# EAGLE design STorM32 NT BGC v242 (EAGLE 7.5.0)
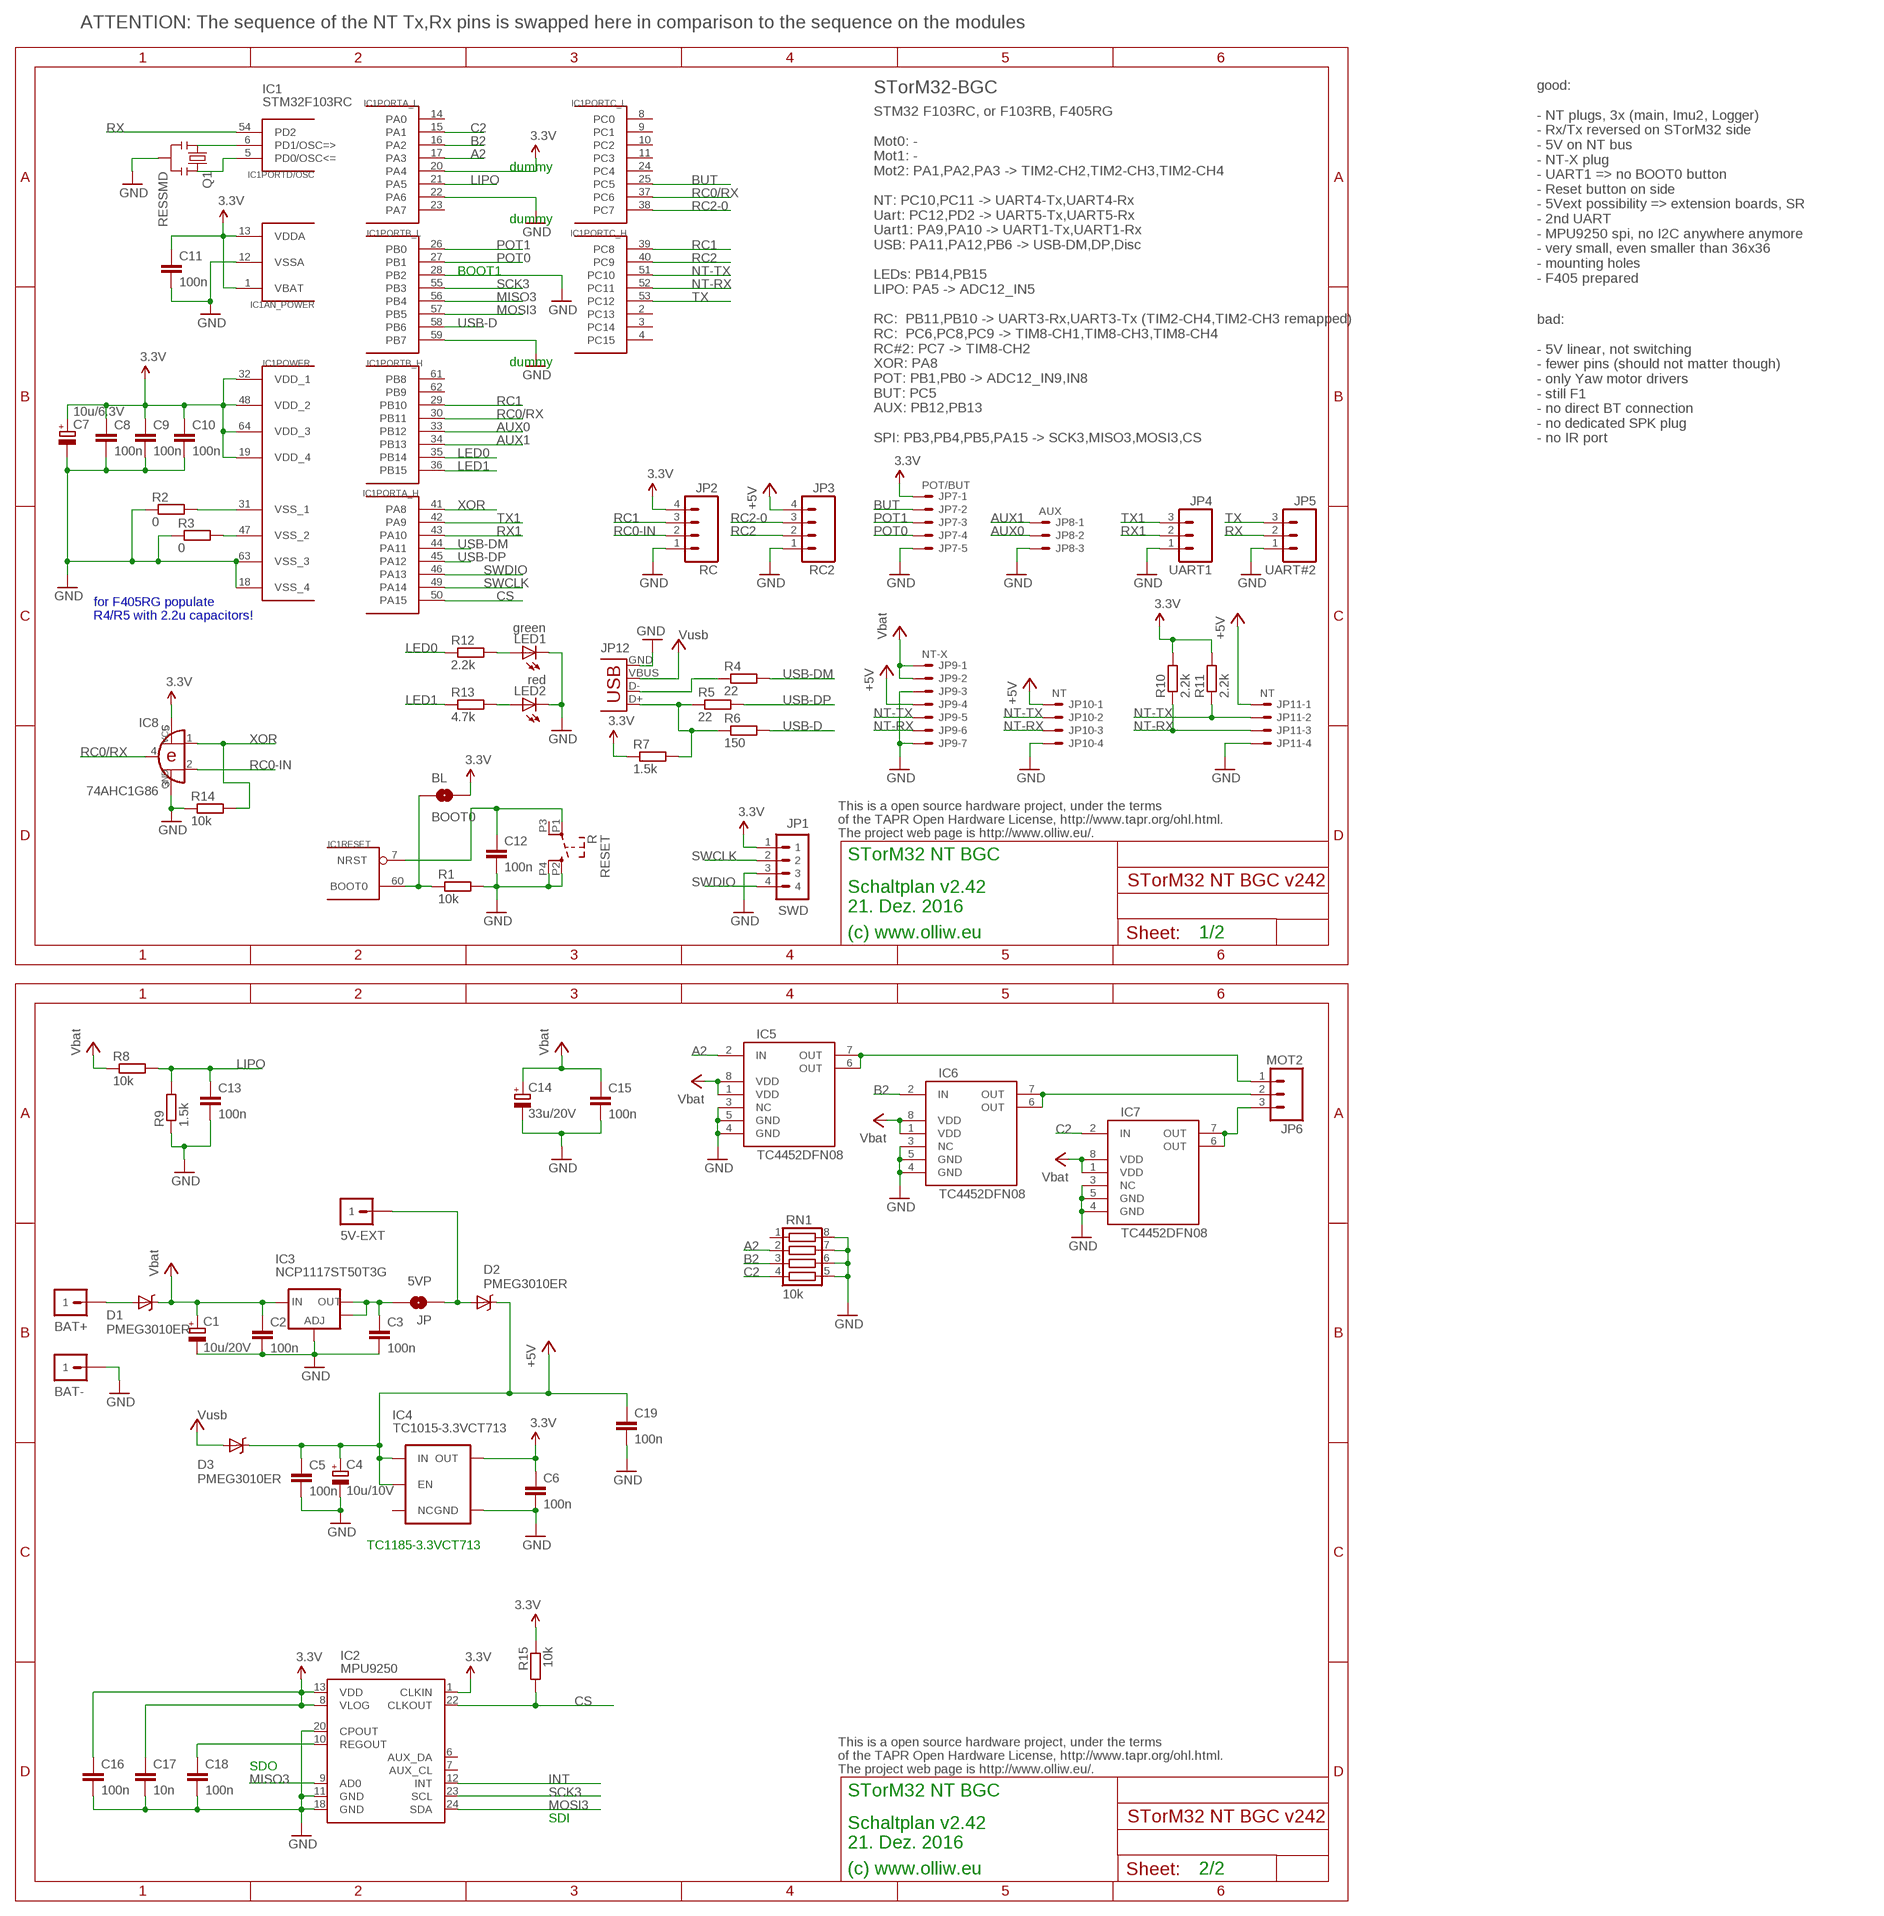
[diagram p0: schematic, sheet 1]

## Parts
5V-EXT  M1X1  [1X1_WITHOUT]
BAT+  M1X1  [1X1_WITHOUT]
BAT-  M1X1  [1X1_WITHOUT]
BL  BOOT0  SOLDERJUMPERNO  [SJ_2S-NO]
C1  10u/20V  CPOL-EUSMCB  [SMC_B]
C2  100n  C-EUC0603  [C0603]
C3  100n  C-EUC0402  [C0402]
C4  10u/10V  CPOL-EUSMCA  [SMC_A]
C5  100n  C-EUC0603  [C0603]
C6  100n  C-EUC0402  [C0402]
C7  10u/6.3V  CPOL-EUSMCA  [SMC_A]
C8  100n  C-EUC0402  [C0402]
C9  100n  C-EUC0402  [C0402]
C10  100n  C-EUC0402  [C0402]
C11  100n  C-EUC0402  [C0402]
C12  100n  C-EUC0402  [C0402]
C13  100n  C-EUC0402  [C0402]
C14  33u/20V  CPOL-EUSMCC  [SMC_C]
C15  100n  C-EUC0603  [C0603]
C16  100n  C-EUC0402  [C0402]
C17  10n  C-EUC0402  [C0402]
C18  100n  C-EUC0402  [C0402]
C19  100n  C-EUC0402  [C0402]
D1  PMEG3010ER  DIODE-SCHOTTKYSOD123-W  [SOD123W-DIODE]
D2  PMEG3010ER  DIODE-SCHOTTKYSOD123-W  [SOD123W-DIODE]
D3  PMEG3010ER  DIODE-SCHOTTKYSOD123-W  [SOD123W-DIODE]
IC1  STM32F103RCT6  STM32F10XRXT6  [TQFP64]
IC2  MPU9250  IMU3000QFN-24-0.4MIL  [QFN-24-3X3]
IC3  NCP1117ST50T3G  V_REG_LM1117SOT223  [SOT223]
IC4  TC1015-3.3VCT713  V_REG_TPS76433SOT23-5  [SOT23-5]
IC5  TC4452DFN08  [DFN8]
IC6  TC4452DFN08  [DFN8]
IC7  TC4452DFN08  [DFN8]
IC8  74AHC1G86  [SOT23-5-VER1]
JP  5VP  SOLDERJUMPERNO  [SJ_2S-NO]
JP1  SWD  P4X1_1P27-OCT_BILEX  [4X1_1P27_OCT_BILEX]
JP2  RC  M041X04_NO_SILK  [1X04_NO_SILK]
JP3  RC2  M041X04_NO_SILK  [1X04_NO_SILK]
JP4  UART1  M031X03_NO_SILK  [1X03_NO_SILK]
JP5  UART#2  M031X03_NO_SILK  [1X03_NO_SILK]
JP6  MOT2  M031X03_NO_SILK  [1X03_NO_SILK]
JP7  POT/BUT  SM05B-SRSS-TB  [SM05B-SRSS-TB]
JP8  AUX  SM03B-SRSS-TB  [SM03B-SRSS-TB]
JP9  NT-X  SM07B-SRSS-TB  [SM07B-SRSS-TB]
JP10  NT  SM04B-SRSS-TB  [SM04B-SRSS-TB]
JP11  NT  SM04B-SRSS-TB  [SM04B-SRSS-TB]
LED1  green  LEDCHIPLED_0603  [CHIPLED_0603]
LED2  red  LEDCHIPLED_0603  [CHIPLED_0603]
Q1  RESSMD  RESONATORSMD  [RESONATOR-SMD]
R1  10k  R-EU_R0402  [R0402]
R2  0  R-EU_R0402  [R0402]
R3  0  R-EU_R0402  [R0402]
R4  22  R-EU_R0402  [R0402]
R5  22  R-EU_R0402  [R0402]
R6  150  R-EU_R0402  [R0402]
R7  1.5k  R-EU_R0402  [R0402]
R8  10k  R-EU_R0402  [R0402]
R9  1.5k  R-EU_R0402  [R0402]
R10  2.2k  R-EU_R0402  [R0402]
R11  2.2k  R-EU_R0402  [R0402]
R12  2.2k  R-EU_R0402  [R0402]
R13  4.7k  R-EU_R0402  [R0402]
R14  10k  R-EU_R0402  [R0402]
R15  10k  R-EU_R0402  [R0402]
RESET  R  SWITCH-SMD-RIGHT-TL1014  [TACTILE-SWITCH-SMD-RIGHT-TL1014]
RN1  10k  CTS742C083  [CTS742C083]
USB  USB-MICROB  [USB-MICROB]

## Nets
3.3V: BL.2 C6.1 C7.+ C8.1 C9.1 C10.1 C11.1 C16.1 C17.1 IC1.1(AN_POWER:VBAT) IC1.13(AN_POWER:VDDA) IC1.19(POWER:VDD_4) IC1.20(PORTA_L:PA4) IC1.32(POWER:VDD_1) IC1.48(POWER:VDD_2) IC1.64(POWER:VDD_3) IC2.1(CLKIN) IC2.8(VLOG) IC2.13(VDD) IC4.5(OUT) IC8.5(VCC) JP1.1 JP2.4 JP7.1 R7.1 R10.2 R11.2 R15.1
5V-EXT: 5V-EXT.1 D2.A JP.1
5V-LDO: C3.1 IC3.2(OUT) IC3.4(OUT) JP.2
+5V: C4.+ C5.1 C19.1 D2.C D3.C IC4.1(IN) IC4.3(EN) JP3.4 JP9.4 JP10.1 JP11.1
A2: IC1.17(PORTA_L:PA3) IC5.2(IN) RN1.2
AUX0: IC1.33(PORTB_H:PB12) JP8.2
AUX1: IC1.34(PORTB_H:PB13) JP8.1
B2: IC1.16(PORTA_L:PA2) IC6.2(IN) RN1.3
BATP: BAT+.1 D1.A
BOOT0: BL.1 IC1.60(RESET:BOOT0) R1.1
BUT: IC1.25(PORTC_L:PC5) JP7.2
C2: IC1.15(PORTA_L:PA1) IC7.2(IN) RN1.4
CS: IC1.50(PORTA_H:PA15) IC2.22(CLKOUT) R15.2
GND: BAT-.1 C1.- C2.2 C3.2 C4.- C5.2 C6.2 C7.- C8.2 C9.2 C10.2 C11.2 C12.2 C13.2 C14.- C15.2 C16.2 C17.2 C18.2 C19.2 IC1.12(AN_POWER:VSSA) IC1.18(POWER:VSS_4) IC1.22(PORTA_L:PA6) IC1.28(PORTB_L:PB2) IC1.59(PORTB_L:PB7) IC1.63(POWER:VSS_3) IC2.11(GND) IC2.18(GND) IC2.20(CPOUT) IC3.1(ADJ) IC4.2(GND) IC5.3(NC) IC5.4(GND) IC5.5(GND) IC6.3(NC) IC6.4(GND) IC6.5(GND) IC7.3(NC) IC7.4(GND) IC7.5(GND) IC8.3(GND) JP1.3 JP2.1 JP3.1 JP4.1 JP5.1 JP7.5 JP8.3 JP9.3 JP9.7 JP10.4 JP11.4 LED1.C LED2.C Q1.2 R1.2 R2.1 R3.1 R9.1 R14.1 RESET.P2 RESET.P4 RN1.5 RN1.6 RN1.7 RN1.8 USB.GND
INT: IC2.12(INT)
LED0: IC1.35(PORTB_H:PB14) R12.1
LED1: IC1.36(PORTB_H:PB15) R13.1
LIPO: C13.1 IC1.21(PORTA_L:PA5) R8.2 R9.2
M2A: IC5.6(OUT) IC5.7(OUT) JP6.1
M2B: IC6.6(OUT) IC6.7(OUT) JP6.2
M2C: IC7.6(OUT) IC7.7(OUT) JP6.3
MISO3: IC1.56(PORTB_L:PB4) IC2.9(AD0)
MOSI3: IC1.57(PORTB_L:PB5) IC2.24(SDA)
N$3: C18.1 IC2.10(REGOUT)
N$8: LED1.A R12.2
N$9: LED2.A R13.2
N$10: IC1.47(POWER:VSS_2) R3.2
N$11: IC1.5(PORTD/OSC:PD0/OSC<=) Q1.3
N$12: IC1.6(PORTD/OSC:PD1/OSC=>) Q1.1
N$15: R4.1 USB.D-
N$17: R5.1 R6.1 R7.2 USB.D+
N$26: IC1.31(POWER:VSS_1) R2.2
NRST: C12.1 IC1.7(RESET:NRST) RESET.P1
NT-RX: IC1.52(PORTC_H:PC11) JP9.6 JP10.3 JP11.3 R10.1
NT-TX: IC1.51(PORTC_H:PC10) JP9.5 JP10.2 JP11.2 R11.1
POT0: IC1.27(PORTB_L:PB1) JP7.4
POT1: IC1.26(PORTB_L:PB0) JP7.3
RC0-IN: IC8.2(I1) JP2.2
RC0/RX: IC1.30(PORTB_H:PB11) IC1.37(PORTC_L:PC6) IC8.4(O)
RC1: IC1.29(PORTB_H:PB10) IC1.39(PORTC_H:PC8) JP2.3
RC2: IC1.40(PORTC_H:PC9) JP3.2
RC2-0: IC1.38(PORTC_L:PC7) JP3.3
RX: IC1.54(PORTD/OSC:PD2) JP5.2
RX1: IC1.43(PORTA_H:PA10) JP4.2
SCK3: IC1.55(PORTB_L:PB3) IC2.23(SCL)
SWCLK: IC1.49(PORTA_H:PA14) JP1.2
SWDIO: IC1.46(PORTA_H:PA13) JP1.4
TX: IC1.53(PORTC_H:PC12) JP5.3
TX1: IC1.42(PORTA_H:PA9) JP4.3
USB-D: IC1.58(PORTB_L:PB6) R6.2
USB-DM: IC1.44(PORTA_H:PA11) R4.2
USB-DP: IC1.45(PORTA_H:PA12) R5.2
VCC: C1.+ C2.1 C14.+ C15.1 D1.C IC3.3(IN) IC5.1(VDD) IC5.8(VDD) IC6.1(VDD) IC6.8(VDD) IC7.1(VDD) IC7.8(VDD) JP9.1 JP9.2 R8.1 ; supply symbol labelled Vbat
VUSB: D3.A USB.VBUS ; supply symbol labelled Vusb
XOR: IC1.41(PORTA_H:PA8) IC8.1(I0) R14.2
Unconnected: IC1.2(PORTC_H:PC13) IC1.3(PORTC_H:PC14) IC1.4(PORTC_H:PC15) IC1.8(PORTC_L:PC0) IC1.9(PORTC_L:PC1) IC1.10(PORTC_L:PC2) IC1.11(PORTC_L:PC3) IC1.14(PORTA_L:PA0) IC1.23(PORTA_L:PA7) IC1.24(PORTC_L:PC4) IC1.61(PORTB_H:PB8) IC1.62(PORTB_H:PB9) IC2.6(AUX_DA) IC2.7(AUX_CL) IC4.4(NC) RESET.P3 RN1.1

## Notes on the sheet
- ATTENTION: The sequence of the NT Tx,Rx pins is swapped here in comparison to the sequence on the modules
- good:
  
  - NT plugs, 3x (main, Imu2, Logger)
  - Rx/Tx reversed on STorM32 side
  - 5V on NT bus
  - NT-X plug
  - UART1 => no BOOT0 button
  - Reset button on side
  - 5Vext possibility => extension boards, SR
  - 2nd UART
  - MPU9250 spi, no I2C anywhere anymore
  - very small, even smaller than 36x36
  - mounting holes
  - F405 prepared
- IC1 | STorM32-BGC
- STM32F103RC
- STM32 F103RC, or F103RB, F405RG
  
  Mot0: -
  Mot1: -
  Mot2: PA1,PA2,PA3 -> TIM2-CH2,TIM2-CH3,TIM2-CH4
  
  NT: PC10,PC11 -> UART4-Tx,UART4-Rx
  Uart: PC12,PD2 -> UART5-Tx,UART5-Rx
  Uart1: PA9,PA10 -> UART1-Tx,UART1-Rx
  USB: PA11,PA12,PB6 -> USB-DM,DP,Disc
  
  LEDs: PB14,PB15
  LIPO: PA5 -> ADC12_IN5
  
  RC:  PB11,PB10 -> UART3-Rx,UART3-Tx (TIM2-CH4,TIM2-CH3 remapped)
  RC:  PC6,PC8,PC9 -> TIM8-CH1,TIM8-CH3,TIM8-CH4
  RC#2: PC7 -> TIM8-CH2
  XOR: PA8
  POT: PB1,PB0 -> ADC12_IN9,IN8
  BUT: PC5
  AUX: PB12,PB13
  
  SPI: PB3,PB4,PB5,PA15 -> SCK3,MISO3,MOSI3,CS
- dummy
- dummy
- BOOT1
- bad:
  
  - 5V linear, not switching
  - fewer pins (should not matter though)
  - only Yaw motor drivers
  - still F1
  - no direct BT connection
  - no dedicated SPK plug
  - no IR port
- dummy
- for F405RG populate
  R4/R5 with 2.2u capacitors!
- JP12
- This is a open source hardware project, under the terms
  of the TAPR Open Hardware License, http://www.tapr.org/ohl.html.
  The project web page is http://www.olliw.eu/.
- STorM32 NT BGC
- Schaltplan v2.42
  21. Dez. 2016
- (c) www.olliw.eu | 1/2
- TC1185-3.3VCT713
- SDO
- This is a open source hardware project, under the terms
  of the TAPR Open Hardware License, http://www.tapr.org/ohl.html.
  The project web page is http://www.olliw.eu/.
- STorM32 NT BGC
- SDI
- Schaltplan v2.42
  21. Dez. 2016
- (c) www.olliw.eu | 2/2

## Library data of the parts
5V-EXT BAT+ BAT- = # stdlib:M1X1
BL JP = # SparkFun2:SOLDERJUMPER: Solder Jumper Standard SMD solder jumper. Used to automate production. Two varients : Normally Open and Normally Closed are the same, but have different paste layers. NC will have a large amount of paste and should jumper during reflow.
C1 C4 C7 C14 = rcl:CPOL-EU: POLARIZED CAPACITOR, European symbol
C2 C3 C5 C6 C8-C13 C15-C19 = rcl:C-EU: CAPACITOR, European symbol
D1-D3 = # stdlib:DIODE-SCHOTTKY
IC1 = # stm32:STM32F10XRXT6: STM32F101/103 64pin LQFP
IC2 = # SparkFun2:IMU3000
IC3 = # SparkFun2:V_REG_LM1117: Voltage Regulator LM1117 Standard adjustable voltage regulator but in SMD form. Spark Fun Electronics SKU : COM-00595
IC4 = # SparkFun2:V_REG_TPS76433: Voltage Regulator Older TI part. LDO 150mA regulator. No output by-pass cap option. See V_REG_LDO for a better part.
IC5-IC7 = # stdlib:TC4452
IC8 = # stdlib:74AHC1G86
JP1 = # stdlib:P4X1_1P27
JP2 JP3 = # SparkFun2:M04: Header 4 Standard 4-pin 0.1" header. Use with straight break away headers (SKU : PRT-00116), right angle break away headers (PRT-00553), swiss pins (PRT-00743), machine pins (PRT-00117), and female headers (PRT-00115). Molex polarized connector foot print use with SKU : PRT-08231 with associated crimp pins and housings. 1MM SMD Version SKU: PRT-10208
JP4-JP6 = # SparkFun2:M03: Header 3 Standard 3-pin 0.1" header. Use with straight break away headers (SKU : PRT-00116), right angle break away headers (PRT-00553), swiss pins (PRT-00743), machine pins (PRT-00117), and female headers (PRT-00115). Molex polarized connector foot print use with SKU : PRT-08232 with associated crimp pins and housings.
JP7 = con-jst2:?M05B-SRSS-TB: Disconnectable Crimp style connector, 1.0mm pitch 5 contacts
JP8 = con-jst2:?M03B-SRSS-TB: Disconnectable Crimp style connector, 1.0mm pitch 3 contacts
JP9 = con-jst2:?M07B-SRSS-TB: Disconnectable Crimp style connector, 1.0mm pitch 7 contacts
JP10 JP11 = con-jst2:?M04B-SRSS-TB: Disconnectable Crimp style connector, 1.0mm pitch 4 contacts
LED1 LED2 = led:LED: LED OSRAM: - CHIPLED LG R971, LG N971, LY N971, LG Q971, LY Q971, LO R971, LY R971 LH N974, LH R974 LS Q976, LO Q976, LY Q976 LO Q996 - Hyper CHIPLED LW Q18S LB Q993, LB Q99A, LB R99A - SideLED LS A670, LO A670, LY A670, LG A670, LP A670 LB A673, LV A673, LT A673, LW A673 LH A674 LY A675 LS A676, LA A676, LO A676, LY A676, LW A676 LS A679, LY A679, LG A679 - Hyper Micro SIDELED® LS Y876, LA Y876, LO Y876, LY Y876 LT Y87S - SmartLED LW L88C, LW L88S LB L89C, LB L89S, LG L890 LS L89K, LO L89K, LY L89K LS L896, LA L896, LO L896, LY L896 - TOPLED LS T670, LO T670, LY T670, LG T670, LP T670 LSG T670, LSP T670, LSY T670, LOP T670, LYG T670 LG T671, LOG T671, LSG T671 LB T673, LV T673, LT T673, LW T673 LH T674 LS T676, LA T676, LO T676, LY T676, LB T676, LH T676, LSB T676, LW T676 LB T67C, LV T67C, LT T67C, LS T67K, LO T67K, LY T67K, LW E67C LS E67B, LA E67B, LO E67B, LY E67B, LB E67C, LV E67C, LT E67C LW T67C LS T679, LY T679, LG T679 LS T770, LO T770, LY T770, LG T770, LP T770 LB T773, LV T773, LT T773, LW T773 LH T774 LS E675, LA E675, LY E675, LS T675 LS T776, LA T776, LO T776, LY T776, LB T776 LHGB T686 LT T68C, LB T68C - Hyper Mini TOPLED® LB M676 - Mini TOPLED Santana® LG M470 LS M47K, LO M47K, LY M47K Source: http://www.osram.convergy.de LUXEON: - LUMILED® LXK2-PW12-R00, LXK2-PW12-S00, LXK2-PW14-U00, LXK2-PW14-V00 LXK2-PM12-R00, LXK2-PM12-S00, LXK2-PM14-U00 LXK2-PE12-Q00, LXK2-PE12-R00, LXK2-PE12-S00, LXK2-PE14-T00, LXK2-PE14-U00 LXK2-PB12-K00, LXK2-PB12-L00, LXK2-PB12-M00, LXK2-PB14-N00, LXK2-PB14-P00, LXK2-PB14-Q00 LXK2-PR12-L00, LXK2-PR12-M00, LXK2-PR14-Q00, LXK2-PR14-R00 LXK2-PD12-Q00, LXK2-PD12-R00, LXK2-PD12-S00 LXK2-PH12-R00, LXK2-PH12-S00 LXK2-PL12-P00, LXK2-PL12-Q00, LXK2-PL12-R00 Source: www.luxeon.com KINGBRIGHT: KA-3528ASYC Source: www.kingbright.com
Q1 = # SparkFun2:RESONATOR: Resonator Small SMD resonator. This is the itty bitty 10/20MHz resonators with built in caps. CSTCE10M0G55 and CSTCE20M0V53. Footprint has been reviewed closely but hasn't been tested yet.
R1-R15 = rcl:R-EU_: RESISTOR, European symbol
RESET = # stdlib:SWITCH-SMD-RIGHT-TL1014
RN1 = resistor-net:CTS742C083: Chip Resistor Array 4 Single Resistor Source: http://www.ctscorp.com/components/Datasheets/CTSChipArrayDs.pdf; OC_FARNELL: unknown; OC_NEWARK: unknown
USB = # SparkFun2:USB: USB Connectors USB-B-PTH is fully proven SKU : PRT-00139 USB-miniB is fully proven SKU : PRT-00587 USB-A-PCB is untested. USB-A-H is throughly reviewed, but untested. Spark Fun Electronics SKU : PRT-00437 USB-B-SMT is throughly reviewed, but untested. Needs silkscreen touching up. USB-A-S has not been used/tested USB-MB-H has not been used/tested

## Board
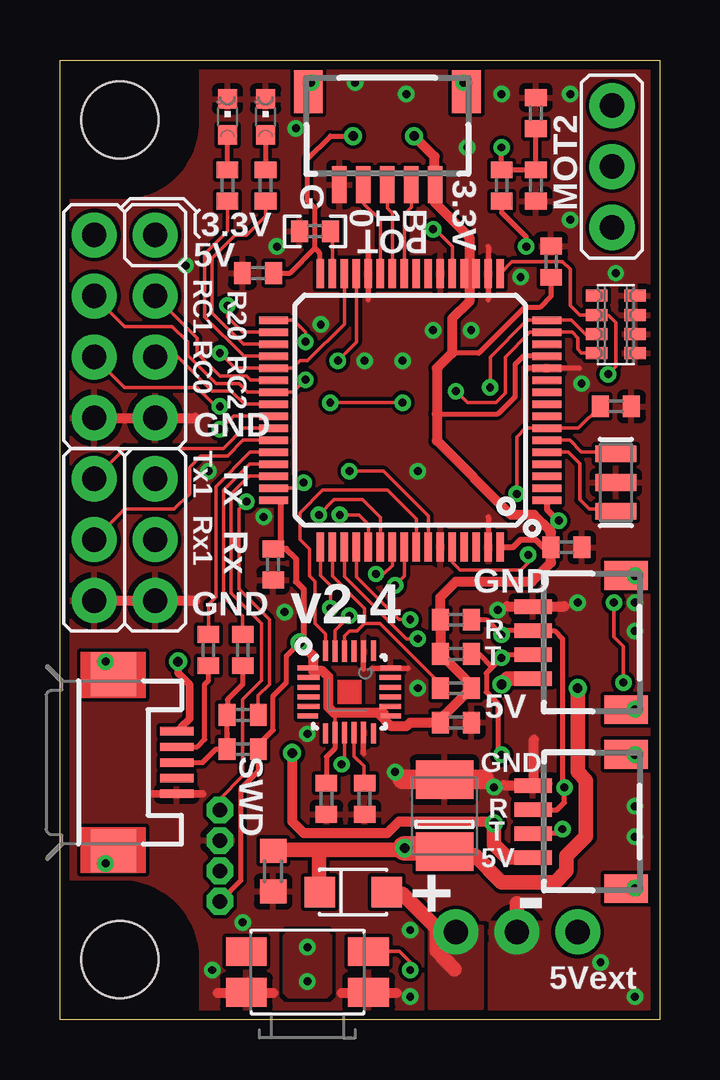
[diagram p1: board, top side]
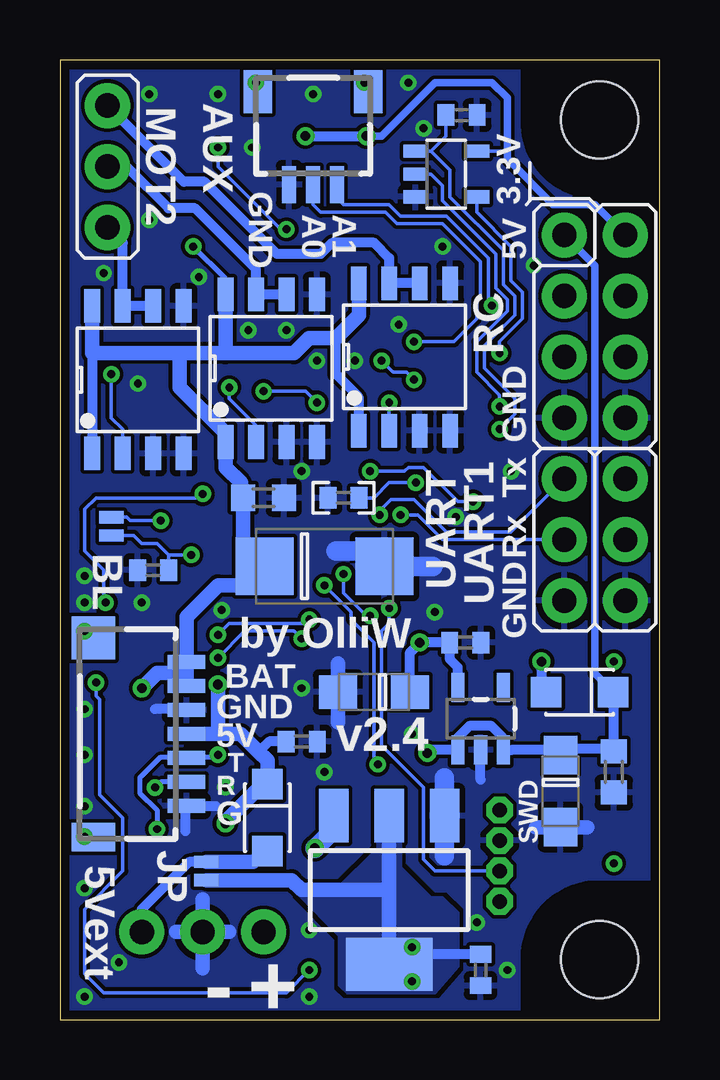
[diagram p2: board, bottom side, seen from below]

Size 25 x 40 mm. Coordinates in mm from the lower left corner, seen from the top.
Outline: 25,0 0,0 0,40 25,40 25,0
Copper layers (1*16): Top 0.0356mm / dielectric 1.5011mm / Bottom 0.0356mm
Design rules "ow-oshpark-2layer": minimum track width 6mil, minimum drill 13mil, track to track 6mil, track to pad 6mil, pad to pad 6mil, via to via 6mil, smd to smd 6mil, copper to edge 15mil, drill to drill 6mil, minimum pad ring 7mil, minimum via ring 7mil, stop-mask expansion 2.5mil, vias tented up to drill 26mil, thermal gap 10mil
Holes 3.2 mm at 2.5,2.5 2.5,37.5

### Footprints (pad centres in the part's own frame; a part is rotated, then mirrored left to right if it is on the bottom)
1X1_WITHOUT = drill 1.016 pad 1.88: 1 0,0
SJ_2S-NO = smd 0.508 x 1.016: 1 -0.381,0; 2 0.381,0
SMC_B = smd 1.6 x 2.4: + -1.5,0; - 1.5,0
C0603 = smd 1 x 1.1: 1 -0.85,0; 2 0.85,0
C0402 = smd 0.7 x 0.9: 1 -0.65,0; 2 0.65,0
SMC_A = smd 1.6 x 1.4: + -1.5,0; - 1.5,0
SMC_C = smd 2.4 x 2.4: + -2.5,0; - 2.5,0
SOD123W-DIODE = smd 1.27 x 1.27: A -1.4,0; C 1.4,0
TQFP64 = smd 1.2 x 0.3: 1 -5.7,3.75; 2 -5.7,3.25; 3 -5.7,2.75; 4 -5.7,2.25; 5 -5.7,1.75; 6 -5.7,1.25; 7 -5.7,0.75; 8 -5.7,0.25; 9 -5.7,-0.25; 10 -5.7,-0.75; 11 -5.7,-1.25; 12 -5.7,-1.75; 13 -5.7,-2.25; 14 -5.7,-2.75; 15 -5.7,-3.25; 16 -5.7,-3.75; 33 5.7,-3.75; 34 5.7,-3.25; 35 5.7,-2.75; 36 5.7,-2.25; 37 5.7,-1.75; 38 5.7,-1.25; 39 5.7,-0.75; 40 5.7,-0.25; 41 5.7,0.25; 42 5.7,0.75; 43 5.7,1.25; 44 5.7,1.75; 45 5.7,2.25; 46 5.7,2.75; 47 5.7,3.25; 48 5.7,3.75 | smd 0.3 x 1.2: 17 -3.75,-5.7; 18 -3.25,-5.7; 19 -2.75,-5.7; 20 -2.25,-5.7; 21 -1.75,-5.7; 22 -1.25,-5.7; 23 -0.75,-5.7; 24 -0.25,-5.7; 25 0.25,-5.7; 26 0.75,-5.7; 27 1.25,-5.7; 28 1.75,-5.7; 29 2.25,-5.7; 30 2.75,-5.7; 31 3.25,-5.7; 32 3.75,-5.7; 49 3.75,5.7; 50 3.25,5.7; 51 2.75,5.7; 52 2.25,5.7; 53 1.75,5.7; 54 1.25,5.7; 55 0.75,5.7; 56 0.25,5.7; 57 -0.25,5.7; 58 -0.75,5.7; 59 -1.25,5.7; 60 -1.75,5.7; 61 -2.25,5.7; 62 -2.75,5.7; 63 -3.25,5.7; 64 -3.75,5.7
QFN-24-3X3 = smd 0.85 x 0.21: 1 -1.725,1; 6 -1.725,-1; 13 1.725,-1; 18 1.725,1 | smd 0.9 x 0.21: 2 -1.7,0.6; 3 -1.7,0.2; 5 -1.7,-0.6; 14 1.7,-0.6; 15 1.7,-0.2; 16 1.7,0.2; 17 1.7,0.6 | smd 0.9 x 0.2: 4 -1.7,-0.2 | smd 0.21 x 0.85: 7 -1,-1.725; 12 1,-1.725; 19 1,1.725; 24 -1,1.725 | smd 0.21 x 0.9: 8 -0.6,-1.7; 9 -0.2,-1.7; 10 0.2,-1.7; 11 0.6,-1.7; 20 0.6,1.7; 21 0.2,1.7; 22 -0.2,1.7; 23 -0.6,1.7
SOT223 = smd 1.219 x 2.235: 1 -2.311,-3.099; 2 0,-3.099; 3 2.311,-3.099 | smd 3.6 x 2.2: 4 0,3.099
SOT23-5 = smd 0.55 x 1.2: 1 -0.95,-1.3; 2 0,-1.3; 3 0.95,-1.3; 4 0.95,1.3; 5 -0.95,1.3
DFN8 = smd 0.66 x 1.397: 1 0,-3.073; 2 1.27,-3.073; 3 2.54,-3.073; 4 3.81,-3.073; 5 3.81,3.073; 6 2.54,3.073; 7 1.27,3.073; 8 0,3.073
SOT23-5-VER1 = smd 0.55 x 0.99: 1 -0.95,-1.29; 2 0,-1.29; 3 0.95,-1.29; 4 0.95,1.3; 5 -0.95,1.3
4X1_1P27_OCT_BILEX = drill 0.61 pad 1.118 octagon: 1 0,0; 2 0,-1.27; 3 0,-2.54; 4 0,-3.81
1X04_NO_SILK = drill 1.016 pad 1.88: 1 0,0; 2 2.54,0; 3 5.08,0; 4 7.62,0
1X03_NO_SILK = drill 1.016 pad 1.88: 1 0,0; 2 2.54,0; 3 5.08,0
SM05B-SRSS-TB = smd 0.6 x 1.55: 1 -2,2.975; 2 -1,2.975; 3 0,2.975; 4 1,2.975; 5 2,2.975 | smd 1.2 x 1.8: FIT@1 -3.3,-0.9; FIT@2 3.3,-0.9
SM03B-SRSS-TB = smd 0.6 x 1.55: 1 -1,2.975; 2 0,2.975; 3 1,2.975 | smd 1.2 x 1.8: FIT@1 -2.3,-0.9; FIT@2 2.3,-0.9
SM07B-SRSS-TB = smd 0.6 x 1.55: 1 -3,2.975; 2 -2,2.975; 3 -1,2.975; 4 0,2.975; 5 1,2.975; 6 2,2.975; 7 3,2.975 | smd 1.8 x 1.8: FIT@1 -4,-0.9 | smd 1.2 x 1.8: FIT@2 4.3,-0.9
SM04B-SRSS-TB = smd 0.6 x 1.55: 1 -1.5,2.975; 2 -0.5,2.975; 3 0.5,2.975; 4 1.5,2.975 | smd 1.2 x 1.8: FIT@1 -2.8,-0.9; FIT@2 2.8,-0.9
CHIPLED_0603 = smd 0.8 x 0.8: A 0,-0.75; C 0,0.75
RESONATOR-SMD = smd 0.7 x 1.7: 1 -1.2,0; 2 0,0; 3 1.2,0
R0402 = smd 0.7 x 0.9: 1 -0.65,0; 2 0.65,0
TACTILE-SWITCH-SMD-RIGHT-TL1014 = smd 1.7 x 1.2: P1 2.55,0.85; P2 2.55,-0.85; P3 -2.55,0.85; P4 -2.55,-0.85
CTS742C083 = smd 0.5 x 0.9: 1 -1.2,-0.8; 2 -0.4,-0.8; 3 0.4,-0.8; 4 1.2,-0.8; 5 1.2,0.8; 6 0.4,0.8; 7 -0.4,0.8; 8 -1.2,0.8
USB-MICROB = smd 0.35 x 1.4: D+ 0,2.65; D- -0.65,2.65; GND 1.3,2.65; ID 0.65,2.65; VBUS -1.3,2.65 | smd 1.8 x 1.9: MT1 -3.683,0; MT2 3.683,0

### Placement (x,y rotation side)
5V-EXT  21.59,3.65 180 top
BAT+  16.51,3.65 90 top
BAT-  19.05,3.65 0 top
BL  22.86,20.56 90 bottom
C1  16.03,8.49 90 top
C2  8.89,6.19 270 top
C3  7.46,2.06 270 bottom
C4  4.13,9.53 270 bottom
C5  1.91,10.32 270 bottom
C6  8.1,15.72 0 bottom
C7  11.91,13.65 180 bottom
C8  21.11,19.68 0 top
C9  8.26,31.11 180 top
C10  8.89,18.97 270 top
C11  20.48,31.59 90 top
C12  23.18,25.56 0 top
C13  19.84,37.78 90 top
C14  13.97,18.89 0 bottom
C15  16.51,21.75 0 bottom
C16  16.51,12.38 0 top
C17  11.11,9.21 270 top
C18  12.7,9.21 270 top
C19  14.92,11.59 0 bottom
D1  12.22,5.32 180 top
D2  16.35,8.41 90 bottom
D3  3.33,13.65 0 bottom
IC1  14.6,25.4 180 top
IC2  12.06,13.65 0 top
IC3  11.27,5.4 180 bottom
IC4  7.46,12.54 0 bottom
IC5  23.65,26.67 0 bottom
IC6  18.1,27.15 0 bottom
IC7  12.54,27.62 0 bottom
IC8  8.89,35.24 270 bottom
JP  18.89,6.19 270 bottom
JP1  6.67,4.92 180 top
JP2  1.43,25.08 90 top
JP3  3.97,25.08 90 top
JP4  1.43,17.46 90 top
JP5  3.97,17.46 90 top
JP6  23.02,33.02 90 top
JP7  13.65,37.78 180 top
JP8  14.45,37.78 180 bottom
JP9  22.7,11.91 270 bottom
JP10  22.7,15.72 90 top
JP11  22.7,8.26 90 top
LED1  8.57,37.62 0 top
LED2  6.98,37.62 0 top
Q1  23.18,22.38 270 top
R1  21.11,18.73 180 bottom
R2  10.64,32.86 0 top
R3  13.18,21.75 0 bottom
R4  6.19,15.4 90 top
R5  7.62,15.4 90 top
R6  7.62,12.7 0 top
R7  7.62,11.27 180 top
R8  18.41,34.77 90 top
R9  19.84,34.77 90 top
R10  16.51,16.67 180 top
R11  16.51,15.24 180 top
R12  8.57,34.77 90 top
R13  6.98,34.77 90 top
R14  8.26,37.7 180 bottom
R15  16.51,13.81 180 top
RESET  10.32,1.98 0 top
RN1  23.18,28.97 270 top
USB  2.22,10.72 270 top

### Tracks (layer width: path | path; a pad name or v marks a point on that pad's centre or on a via)
3.3V  (via drill 0.33, 0.4)
  Top 0.152: 10.84,31.11 IC1.32 | 15.62,34.87 JP7.1 | 20.47,21.64 IC1.1 | 20.5,19.74 C8.1 | 9.07,21.64 IC1.48 9.12,21.59 9.21,21.59 | 17.16,13.94 R15.1 17.15,13.81 | R7.1 8.1,11.27 | 15.59,12.65 15.7,12.38 C16.1 16.03,12.56 16.03,12.7 | IC2.8 11.47,12.74 11.43,12.78 | 20.48,19.7 C8.1 | v20.8,20.8 20.77,20.8 20.77,20.77 | 20.48,19.67 C8.1 | IC2.1 10.37,14.68 10.56,14.68 | IC2.13 13.38,12.65 13.26,12.78 | IC1.19 IC1.20 17.21,31.1 17.07,31.27
  Top 0.203: IC1.13 19.32,27.65 18.97,27.3 18.97,25.96 18.26,25.24 15.72,25.24 | C11.1 20.48,30.16 20,29.69 19.37,29.69 17.46,27.78 16.35,27.78 | R7.1 8.27,10.33 7.54,9.6 7.54,5.79 JP1.1 | 8.1,11.27 8.89,12.06 8.89,13.49 9.45,14.05 9.45,15.16 v10,15.72 | C17.1 11.11,10.95 11.47,11.31 IC2.8 | 10.84,31.11 10.84,31.94 10.64,32.15 | 10.64,32.15 10.64,33.81 10.32,34.13 10.32,35.88 11.27,36.83 v12.22,36.83 | C9.1 9.6,31.11 10.64,32.15
  Top 0.254: 9.21,21.59 9.21,19.68 9.14,19.62 C10.1 9.43,19.62 9.84,19.21 9.84,18.26 10.16,17.94 10.16,15.88 v10,15.72 | IC1.1 20.3,21.26 20.77,20.8 | IC1.64 18.91,19.7 19.21,20 19.83,20 20.16,19.68 C8.1 | 20.77,20.77 20.4,20.4
  Top 0.406: 15.62,34.87 15.62,35.97 v14.76,36.83 | JP7.1 15.65,34.04 17.07,32.62 17.07,31.27 17.07,29.92 16.35,29.21 16.35,27.78 15.72,27.15 15.72,25.24 15.72,24.13 18.81,21.03 19.76,21.03 20.4,20.4 20.48,20.32 20.48,19.7 | 17.16,13.94 R11.2 R10.2 15.86,17.61 16.51,18.26 19.69,18.26 20.48,19.05 20.48,19.67 | 17.15,13.81 16.03,12.7 | 13.49,12.78 13.26,12.78 | 13.26,12.78 11.43,12.78 11.19,13.02 11.19,14.29 10.95,14.53 10.56,14.53 10.56,14.68 10.56,15.16 v10,15.72 | 15.7,12.38 14.6,12.38 14.45,12.22 13.81,12.22 13.26,12.78
  Bottom 0.152: BL.2 22.56,20.95 22.23,20.95 22.07,20.8 v20.8,20.8 | IC8.5 6.35,36.19 6.35,36.2
  Bottom 0.305: JP2.4 2.7,33.97 4.45,33.97 6.35,35.88 6.35,36.2 6.35,38.42 6.98,39.05 9.37,39.05 11.59,36.83 v12.22,36.83
  Bottom 0.406: v14.76,36.83 v12.22,36.83 | C6.1 8.89,15.56 8.9,15.54 | C6.1 8.95,15.66 9.05,15.72 v10,15.72 10.41,15.31 C7.+ | IC4.5 8.41,14.68 8.73,15 8.73,15.66 C6.1
5V-EXT
  Bottom 0.406: JP.1 19.62,6.57 21.59,4.6 5V-EXT.1
  Bottom 0.61: JP.1 16.95,6.57 D2.A
5V-LDO  (via drill 0.33)
  Bottom 0.152: 10.86,2.71 IC3.4
  Bottom 0.406: C3.1 10.86,2.71
  Bottom 0.61: IC3.2 11.27,5.4 | 11.27,5.4 IC3.4 | JP.2 15.33,5.81 14.92,5.4 11.27,5.4
  other vias: 10.32,1.59 10.32,3.02
  pour Bottom (no thermals): 10.79,8.1 10.79,6.35 9.53,5.08 9.05,5.08 8.41,4.45 8.41,2.22 9.37,1.11 13.02,1.11 13.33,1.43 13.33,3.49 15.08,5.24 15.08,5.4 13.49,5.4 11.75,7.14 11.75,8.1
  pour Top: 9.53,3.65 9.37,3.49 9.37,1.11 9.53,0.95 11.11,0.95 11.27,1.11 11.27,3.49 11.11,3.65
+5V  (via drill 0.4)
  Top 0.152: 19.71,6.76 JP11.1
  Top 0.406: v9.68,11.11 9.68,8.26 10.16,7.78 13.65,7.78 14.13,8.26 17.94,8.26 v18.1,8.18
  Top 0.61: JP10.1 18.66,14.22 v18.41,13.97 | 19.71,6.76 18.64,6.76 18.1,7.3 v18.1,8.18
  Bottom 0.152: 6.19,11.23 IC4.3 | 3.87,11.23 C4.+ | 8.41,11.1 IC4.1 | 16.7,9.81 16.51,9.94 D2.C
  Bottom 0.305: JP3.4 2.7,31.43 2.7,14.42 D3.C | 1.93,11.16 C5.1 | 4.18,11.29 C4.+
  Bottom 0.406: 3.87,11.23 6.19,11.23 | 8.41,11.1 8.41,11.75 7.93,12.23 7,12.23 6.53,11.76 IC4.3 | D3.C 1.93,11.16 | C5.1 1.91,11.27 4.13,11.27 4.18,11.29 | IC4.1 9.55,11.24 v9.68,11.11 | C19.1 16.27,11.59 16.71,11.15
  Bottom 0.61: 16.51,9.94 16.51,9.84 18.1,8.26 v18.1,8.18 | 18.41,11.91 v18.41,13.97 | JP9.4 18.41,11.91 | 18.41,11.91 17.46,11.91 16.71,11.15 16.35,10.79 D2.C
A2  (via drill 0.33)
  Top 0.152: v22.86,26.9 23.18,27.22 23.18,29.05 22.88,29.34 22.28,29.34 RN1.2 22.22,29.37 21.67,29.37 21.27,29.77 21.27,31.27 20.95,31.59 18.85,31.59 IC1.17
  Bottom 0.152: IC5.2 22.38,24.61 22.86,25.08 v22.86,26.9
AUX0  (via drill 0.33)
  Top 0.152: IC1.33 9.74,29.15 10.24,28.65 v10.24,28.26
  Bottom 0.152: v10.24,28.26 8.57,28.26 7.62,29.21 7.62,30 7.46,30.16 7.46,31.59 9.05,33.18 10.95,33.18 11.43,33.66 14.13,33.66 14.45,33.97 JP8.2
AUX1  (via drill 0.33)
  Top 0.152: v6.98,29.77 6.98,29.29 7.62,28.65 IC1.34
  Bottom 0.152: v6.98,29.77 7.14,29.92 7.14,31.75 8.89,33.5 10.79,33.5 11.27,33.97 13.18,33.97 13.49,34.29 13.49,34.7 JP8.1 13.4,34.77
B2  (via drill 0.33)
  Top 0.152: RN1.3 21.91,28.57 21.33,29.15 IC1.16 19.47,29.15 17.94,27.62 v17.94,26.35
  Bottom 0.152: 16.85,24.23 IC6.2 16.83,24.77 17.94,25.88 v17.94,26.35
BATP
  Top 0.152: 13.58,5.26 13.18,5.26 D1.A | 16.44,2.09 16.35,2.06
  Top 0.61: 16.44,2.09 15.72,2.86 15.72,3.81 14.29,5.24 13.77,5.24 13.58,5.26
  pour Top (no thermals): 15.4,3.89 15.4,0.48 17.62,0.48 17.62,3.89
BOOT0  (via drill 0.33)
  Top 0.152: IC1.60 16.35,19.05 16.67,18.73 19.21,18.73 19.53,19.05 v19.53,19.37
  Bottom 0.152: 22.56,20.18 22.54,20.16 | v19.53,19.37 20.48,19.37 | 20.48,19.37 20.95,19.84 21.59,19.84 21.92,20.18 22.56,20.18 | 22.56,20.18 BL.1 | 20.48,19.37 20.46,19.35 R1.1
BUT
  Top 0.152: IC1.25 14.35,33.56 14.65,33.86 JP7.2
C2  (via drill 0.33)
  Top 0.152: RN1.4 22.37,27.78 21.75,27.78 21.59,27.94 21.59,28.42 21.36,28.65 IC1.15 19.6,28.65 18.57,27.62 18.57,26.11 18.18,25.72 16.99,25.72 v16.51,26.19 | v14.29,25.72 v11.27,25.72
  Bottom 0.152: 11.28,24.87 IC7.2 | v16.51,26.19 14.76,26.19 v14.29,25.72 | 11.27,24.29 IC7.2 | IC7.2 v11.27,25.72
CS
  Top 0.152: IC2.22 11.87,15.99 12.06,16.19 12.38,16.19 12.7,16.51 | R15.2 15.86,13.97 15.87,13.8 15.87,13.97 13.33,16.51 12.7,16.51 | IC1.50 11.35,18.49 12.7,17.14 12.7,16.51
GND  (via drill 0.33)
  Top 0.152: 12.66,15.67 12.67,15.67 IC2.20
  Top 0.203: 17.86,32.23 17.86,30 | 12.86,30 12.86,32.23 | 21.67,27.15 19.45,27.15 | 17.86,20.95 17.86,19.45 | 13.02,14.64 14.53,14.64 | 12.66,14.61 12.66,15.67 | 12.66,11.07 12.66,12.27
  Top 0.305: 3.73,9.4 5.95,9.4
  Top 0.406: 18.65,17.22 21.03,17.22 | 18.49,9.76 20.24,9.76 | 19.76,9.84 19.76,11.67 | 11.75,1.11 14.05,1.11 | JP2.1 5.64,25.08 | JP4.1 5.64,17.46 | 6.59,1.11 8.89,1.11
  Top 0.61: BAT-.1 19.05,4.84
  Top 0.813: 14.29,10 17.7,10
  Bottom 0.406: 19.29,12.94 21.03,12.94 | 18.49,8.89 19.76,8.89 | 19.76,8.89 20.32,8.89 | 19.76,7.86 19.76,8.89 | 7.46,10 7.46,11.51
  Bottom 0.61: 5.16,8.02 3.02,8.02 | 13.41,14.84 13.41,12.38 | 19.05,5 19.05,2.14 | 17.94,3.65 20.16,3.65
  Bottom 0.813: 11.91,18.89 9.45,18.89 | 8.97,10.08 8.97,6.83 | 11.67,19.53 13.49,19.53
  other vias: 15.56,28.73 17.15,28.73 19.21,30.96 14.29,27.46 12.7,27.46 10.87,28.97 9.05,32.23 5.24,31.43 16.99,36.35 9.84,37.15 14.45,38.58 18.41,38.58 21.27,38.58 14.92,22.86 9.37,16.99 14.92,13.81 13.97,10.32 10.32,11.91 7.62,4.05 14.6,3.73 21.59,17.38 21.75,26.51 23.18,31.11 21.27,33.34 23.97,8.89 23.97,0.95 22.54,2.38 18.26,17.07 6.35,2.06 14.6,0.95 23.97,7.62 23.97,5.48 23.97,11.03 23.97,12.94 23.97,16.19 23.97,18.49 12.3,39.05 10.48,39.05 8.49,20.95 6.19,22.86 18.1,9.68 23.97,17.38
  pour Top (isolate 0.152, rank 6): 5.87,-0.16 5.87,2.54 arc90 2.54,5.87 -0.63,5.87 -0.63,34.13 2.54,34.13 arc90 5.87,37.31 5.87,40.32 25.23,40.32 25.23,-0.16
  pour Bottom (isolate 0.152, rank 6): 5.87,-0.16 5.87,2.54 arc90 2.54,5.87 -0.63,5.87 -0.63,34.13 2.54,34.13 arc90 5.87,37.31 5.87,40.32 25.23,40.32 25.23,-0.16
  pour Top (no thermals): 20.16,4.05 20.16,0.48 17.94,0.48 17.94,4.05
LED0
  Top 0.152: R12.1 8.57,33.5 7.78,32.7 7.3,32.7 6.35,31.75 6.35,29.45 7.65,28.15 IC1.35
LED1
  Top 0.152: R13.1 6.98,32.86 6.03,31.91 6.03,29.29 7.67,27.65 IC1.36
LIPO  (via drill 0.33)
  Top 0.152: 20.02,37.29 C13.1 | IC1.21 16.35,32.22 15.64,32.94 v15.56,32.94
  Top 0.203: C13.1 R9.2 R8.2 v18.41,36.35
  Bottom 0.152: v15.56,32.94 15.8,32.94 18.41,35.56 v18.41,36.35
M2A
  Bottom 0.406: JP6.1 22.38,32.38 IC5.7 IC5.6
M2B
  Bottom 0.406: IC6.6 IC6.7 16.83,31.27 19.37,33.81 20.48,33.81 22.23,35.56 JP6.2
M2C
  Bottom 0.406: IC7.6 IC7.7 11.27,31.75 11.91,32.38 13.65,32.38 14.13,31.91 15.95,31.91 18.97,34.92 19.84,34.92 JP6.3
MISO3  (via drill 0.33)
  Top 0.152: IC1.56 14.35,18.48 v13.97,18.1 | IC2.9 11.87,10.75 v11.75,10.64
  Bottom 0.152: v13.97,18.1 12.86,16.99 12.86,16.67 11.91,15.72 11.91,10.79 v11.75,10.64
MOSI3
  Top 0.152: IC1.57 14.85,20.86 13.65,22.07 10.95,22.07 10,21.11 10,20 10.4,19.61 10.4,18.49 10.64,18.26 10.64,16.51 11.06,16.08 IC2.24
N$1  (via drill 0.33)
  other vias: 1.91,14.92
N$2  (via drill 0.33)
  other vias: 1.91,6.51
N$3
  Top 0.152: C18.1 12.68,9.86 12.68,10.56 12.27,10.98 12.27,11.94 IC2.10
N$4  (via drill 0.33)
  other vias: 16.83,39.05
N$8
  Top 0.152: 8.58,36.85 LED1.A | 8.58,35.28 R12.2
  Top 0.203: 8.58,35.28 8.58,36.85
N$9
  Top 0.203: R13.2 LED2.A
N$10  (via drill 0.33)
  Top 0.152: IC1.47 9.93,22.15 v10.16,22.38
  Bottom 0.152: v10.16,22.38 11.27,22.38 11.91,21.75 R3.2
N$11
  Top 0.152: IC1.5 21.2,23.65 21.67,23.18 21.67,21.67 22.07,21.27 23.25,21.27 Q1.3
N$12
  Top 0.152: IC1.6 21.25,24.15 21.75,23.65 23.25,23.65 | 23.81,23.65 23.25,23.65 | 23.25,23.65 Q1.1
N$15
  Top 0.203: USB.D- 5.73,11.37 6.03,11.67 6.03,13.97 6.19,14.13 R4.1
N$17
  Top 0.152: 6.98,12.71 R6.1
  Top 0.203: R5.1 7.62,13.97 6.98,13.34 6.98,12.71 | R7.2 R6.1 6.98,11.27 6.51,11.27 5.95,10.72 USB.D+
N$26
  Top 0.152: IC1.31 11.35,32.63 R2.2
NRST  (via drill 0.33)
  Top 0.152: C12.1 21.62,24.65 IC1.7 19.41,24.65 19.05,24.29 v19.05,21.91 | 12.88,2.9 RESET.P1 14.15,2.83 14.6,2.38 v14.6,2.06 | v23.1,17.38 23.1,15.95 23.49,15.56 v23.49,14.05
  Bottom 0.152: v14.6,2.06 15.56,1.11 23.18,1.11 23.97,1.91 23.97,4.6 22.38,6.19 22.38,8.41 23.34,9.37 23.34,13.34 23.49,13.49 v23.49,14.05 | v19.05,21.91 19.21,21.75 23.49,21.75 23.97,21.27 23.97,19.53 23.18,18.73 23.18,17.46 v23.1,17.38
NT-RX  (via drill 0.33)
  Top 0.152: JP11.3 19.75,8.73 | IC1.52 12.35,18.44 14.13,16.67 v14.6,16.67
  Top 0.203: 19.75,8.73 20.72,8.73 21.03,9.05 v21.03,9.67 21.03,9.92 20.95,10 20.95,15.88 20.61,16.22 JP10.3 18.6,16.22 v18.41,16.03 17.78,16.67 R10.1
  Bottom 0.152: v14.6,16.67 14.76,16.51 17.94,16.51 v18.41,16.03
  Bottom 0.203: JP9.6 20.8,9.91 v21.03,9.67
NT-TX  (via drill 0.33)
  Top 0.152: 20.07,15.21 JP10.2 | JP11.2 19.75,7.78 | R11.1 17.46,15.24 | IC1.51 11.85,18.47 14.45,15.88 v14.92,15.88
  Top 0.203: JP10.2 18.55,15.22 v18.41,15.08 18.02,14.68 | 19.75,7.78 20.8,7.78 v20.95,7.94 | 18.02,14.68 17.78,14.45 17.78,13.65 18.26,13.18 18.26,11.19 v18.41,11.03 | 17.46,15.24 18.02,14.68
  Bottom 0.152: 19.74,10.92 JP9.5 | v14.92,15.88 15.24,16.19 17.3,16.19 v18.41,15.08
  Bottom 0.203: v18.41,11.03 18.53,10.92 19.74,10.92 20.83,10.92 21.67,10.08 21.67,9.45 20.95,8.73 v20.95,7.94
POT0
  Top 0.152: IC1.27 13.35,33.32 12.65,34.02 JP7.4
POT1
  Top 0.152: IC1.26 13.85,33.61 13.65,33.81 JP7.3
RC0-IN  (via drill 0.33)
  Top 0.152: JP2.2 2.7,26.35 5.71,26.35 6.51,25.56 v6.67,25.56
  Bottom 0.152: v6.67,25.56 6.67,26.04 7.62,26.99 7.62,28.26 6.35,29.53 6.35,30 6.83,30.48 6.83,31.91 9.05,34.13 9.05,34.77 9.53,35.24 IC8.2
RC0/RX  (via drill 0.33)
  Top 0.152: IC1.30 11.85,29 10.32,27.46 10,27.46 9.69,27.15 IC1.37 7.3,27.15 v6.67,27.78
  Bottom 0.152: v6.67,27.78 6.67,28.26 5.71,29.21 5.71,30.32 6.19,30.8 6.19,32.23 7.62,33.66 7.62,34.32 IC8.4
RC1  (via drill 0.33)
  Top 0.152: JP2.3 2.7,28.89 4.68,28.89 5.32,28.26 5.32,27.7 6.51,26.51 7.46,26.51 7.82,26.15 IC1.39 9.72,26.15 v10.24,26.67 | IC1.29 12.35,28.23 v11.59,27.46
  Bottom 0.152: v11.59,27.46 11.11,26.99 10.56,26.99 v10.24,26.67
RC2
  Top 0.152: JP3.2 4.92,27.62 6.35,26.19 7.14,26.19 7.69,25.65 IC1.40
RC2-0
  Top 0.152: JP3.3 5.71,28.42 5.71,27.78 6.67,26.83 7.78,26.83 7.96,26.65 IC1.38
RX  (via drill 0.33)
  Top 0.152: IC1.54 13.35,20.93 12.62,21.67 11.43,21.67 v10.79,21.03
  Bottom 0.152: v10.79,21.03 10.08,21.03 9.05,20 JP5.2
RX1
  Top 0.152: IC1.43 7.64,24.15 6.98,23.5 5.87,23.5 5.4,23.02 5.4,21.91 4.76,21.27 2.7,21.27 JP4.2
SCK3  (via drill 0.33)
  Top 0.152: IC1.55 13.85,18.93 13.49,18.57 v13.18,18.57 | IC2.23 11.47,16.23 v12.06,16.83
  Bottom 0.152: v12.06,16.83 12.22,16.83 13.18,17.78 v13.18,18.57
SWCLK  (via drill 0.33)
  Top 0.152: IC1.49 10.87,19.68 10.87,18.5 11.27,18.1 v11.27,17.14
  Bottom 0.152: JP1.2 9.37,6.19 9.84,6.67 9.84,9.68 11.59,11.43 11.59,16.19 11.27,16.51 v11.27,17.14
SWDIO
  Top 0.152: IC1.46 7.89,22.65 7.14,21.91 7.14,17.78 8.41,16.51 8.41,14.13 7.62,13.34 7.62,10.16 6.67,9.21 JP1.4
TX  (via drill 0.33)
  Top 0.152: IC1.53 12.85,20.64 12.46,21.03 v11.67,21.03
  Bottom 0.152: JP5.3 6.19,20.32 8.89,20.32 10.24,21.67 11.19,21.67 11.67,21.19 v11.67,21.03
TX1
  Top 0.152: IC1.42 7.66,24.65 6.83,23.81 2.7,23.81 JP4.3
USB-D  (via drill 0.33)
  Top 0.152: v7.78,21.59 7.46,21.27 7.46,17.94 8.73,16.67 8.73,13.97 8.27,13.51 R6.2 | IC1.58 15.35,21 13.49,22.86 v12.06,22.86
  Bottom 0.152: v12.06,22.86 10.64,22.86 10.48,23.02 9.84,23.02 8.41,21.59 v7.78,21.59
USB-DM
  Top 0.152: IC1.44 7.93,23.65 6.51,22.23 6.51,17.62 6.19,17.3 R4.2
USB-DP
  Top 0.152: IC1.45 7.91,23.15 6.83,22.07 6.83,17.62 7.62,16.83 R5.2
VCC  (via drill 0.33, 0.4)
  Top 0.152: 10.79,5.43 D1.C | 10.79,6.91 10.95,7.07 | v14.37,7.14 14.45,6.99 14.37,7.07
  Top 0.203: v19.45,32.23 19.45,32.62 18.41,33.66 R8.1
  Top 0.61: 15.64,7.14 15.88,6.91 C1.+ 17.3,6.83 18.41,5.71 19.7,5.71 20.65,5.71 21.11,6.19 21.11,6.81 21.93,7.63 21.93,9.98 21.59,10.32 v21.59,13.81 | v14.37,7.14 14.37,7.07 10.95,7.07 8.82,7.07 8.69,7.04 C2.1 | 10.79,5.43 10.79,6.91
  Top 1.016: 15.64,7.14 v14.37,7.14
  Bottom 0.152: 12.55,24.87 IC7.1 | 18.09,24.23 IC6.1 18.14,24.28 | 17.46,21.73 C15.1 | 19.84,14.45 19.73,14.56 JP9.1 | 16.83,18.1 16.47,18.3 C14.+
  Bottom 0.203: IC6.8 18.1,30.88 v19.45,32.23
  Bottom 0.406: 23.65,27.78 IC5.1 | 12.55,24.87 12.55,25.96 13.49,26.9 13.49,28.42 | 18.14,24.28 18.14,24.49
  Bottom 0.61: IC5.8 23.65,27.78 20,27.78 | IC6.8 18.1,27.78 | 18.1,27.78 20,27.78 | IC7.8 12.54,29.37 13.49,28.42 14.6,28.42 15.24,27.78 18.1,27.78 | 17.46,21.73 17.46,22.38 18.1,23.02 18.09,24.23 | 18.14,24.49 20,26.35 20,27.78 | JP9.2 JP9.1 19.73,16.79 18.41,18.1 16.83,18.1 | C15.1 17.36,19.78 C14.+ | IC3.3 13.58,7.93 | v21.59,13.81 20.95,14.45 19.84,14.45
  Bottom 0.813: 13.58,7.93 v14.37,7.14
VUSB  (via drill 0.4)
  Top 0.305: USB.VBUS 5.05,12.1 5.05,12.19 5.4,12.54 5.4,13.97 4.92,14.45 v4.92,14.92
  Bottom 0.305: D3.A 4.89,13.46
  Bottom 0.406: 4.89,13.46 v4.92,14.92
XOR  (via drill 0.33)
  Top 0.152: IC1.41 7.23,25.15 v6.67,24.61
  Bottom 0.152: 9.53,36.2 8.73,35.4 8.73,34.29 6.51,32.07 6.51,30.64 6.03,30.16 6.03,29.37 7.3,28.1 7.3,27.15 6.03,25.88 6.03,25.24 v6.67,24.61 | 9.53,36.2 10.02,36.2 10.02,36.19 IC8.1 | R14.2 8.9,36.81 9.53,36.2
(copper drawn outside any net)
  shapes: Top area x2

### Text on the board
tNames: MOT2 | G | 3.3V | 3.3V | 0 | 1 | B | POT | 5V | RC1 | R20 | RC0 | RC2 | GND | Tx1 | Tx | Rx1 | Rx | GND | GND | v2.4 | R | T | 5V | GND | SWD | R | T | 5V | + | - | 5Vext
bNames: MOT2 | GND | 3.3V | A1 | A0 | AUX | 5V | RC | GND | Tx | Rx | BL | UART | UART1 | GND | by OlliW | BAT | GND | v2.4 | 5V | SWD | T | R | G | JP | 5Vext | + | -